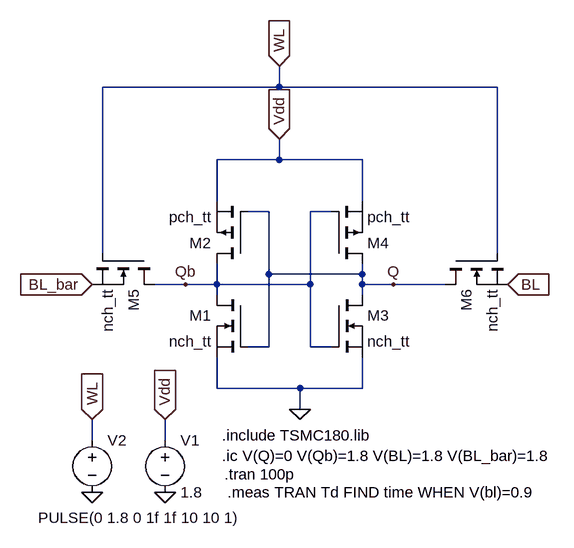
[diagram p0: schematic Prob_1.asc]
Prob_1.asc, the LTspice schematic file:
Version 4
SHEET 1 880 680
WIRE 240 -176 240 -208
WIRE 240 -176 -32 -176
WIRE 576 -176 240 -176
WIRE 240 -64 240 -96
WIRE 240 -64 144 -64
WIRE 368 -64 240 -64
WIRE 144 0 144 -64
WIRE 368 0 368 -64
WIRE 224 16 192 16
WIRE 320 16 288 16
WIRE -32 80 -32 -176
WIRE 576 80 576 -176
WIRE 224 112 224 16
WIRE 368 112 368 96
WIRE 368 112 224 112
WIRE 96 128 48 128
WIRE 144 128 144 96
WIRE 144 128 96 128
WIRE 288 128 288 16
WIRE 288 128 144 128
WIRE 368 128 368 112
WIRE 416 128 368 128
WIRE 496 128 416 128
WIRE 144 144 144 128
WIRE 368 144 368 128
WIRE 224 224 224 112
WIRE 224 224 192 224
WIRE 288 224 288 128
WIRE 320 224 288 224
WIRE 144 288 144 240
WIRE 272 288 144 288
WIRE 368 288 368 240
WIRE 368 288 272 288
WIRE 272 320 272 288
WIRE -48 368 -48 336
WIRE 64 368 64 336
FLAG 272 320 0
FLAG 64 448 0
FLAG 64 336 Vdd
IOPIN 64 336 In
FLAG 240 -96 Vdd
IOPIN 240 -96 In
FLAG 240 -208 WL
IOPIN 240 -208 In
FLAG -48 128 BL_bar
IOPIN -48 128 In
FLAG 592 128 BL
IOPIN 592 128 In
FLAG 96 128 Qb
FLAG 416 128 Q
FLAG -48 448 0
FLAG -48 336 WL
IOPIN -48 336 In
SYMBOL nmos 192 144 M0
SYMATTR InstName M1
SYMATTR Value nch_tt
SYMATTR Value2 W=720n,L=180n
SYMBOL nmos 320 144 R0
SYMATTR InstName M3
SYMATTR Value nch_tt
SYMATTR Value2 W=720n,L=180n
SYMBOL pmos 192 96 R180
SYMATTR InstName M2
SYMATTR Value pch_tt
SYMATTR Value2 W=270n,L=270n
SYMBOL pmos 320 96 M180
SYMATTR InstName M4
SYMATTR Value pch_tt
SYMATTR Value2 W=270n,L=270n
SYMBOL nmos 48 80 R90
SYMATTR InstName M5
SYMATTR Value nch_tt
SYMATTR Value2 W=360n,L=180n
SYMBOL nmos 496 80 M90
SYMATTR InstName M6
SYMATTR Value nch_tt
SYMATTR Value2 W=360n,L=180n
SYMBOL voltage 64 352 R0
WINDOW 123 0 0 Left 0
WINDOW 39 0 0 Left 0
SYMATTR InstName V1
SYMATTR Value 1.8
SYMBOL voltage -48 352 R0
WINDOW 3 -83 135 Left 2
WINDOW 123 0 0 Left 0
WINDOW 39 0 0 Left 0
SYMATTR InstName V2
SYMATTR Value PULSE(0 1.8 0 1f 1f 10 10 1)
TEXT 152 360 Left 2 !.include TSMC180.lib
TEXT 152 392 Left 2 !.ic V(Q)=0 V(Qb)=1.8 V(BL)=1.8 V(BL_bar)=1.8
TEXT 156 420 Left 2 !.tran 100p
TEXT 160 448 Left 2 !.meas TRAN Td FIND time WHEN V(bl)=0.9

The netlist it stands for:
* Prob_1.asc
M1 Qb Q 0 0 nch_tt W=720n,L=180n
M3 Q Qb 0 0 nch_tt W=720n,L=180n
M2 Qb Q Vdd Vdd pch_tt W=270n,L=270n
M4 Q Qb Vdd Vdd pch_tt W=270n,L=270n
M5 Qb WL BL_bar BL_bar nch_tt W=360n,L=180n
M6 Q WL BL BL nch_tt W=360n,L=180n
V1 Vdd 0 1.8
V2 WL 0 PULSE(0 1.8 0 1f 1f 10 10 1)
.model NMOS NMOS
.model PMOS PMOS
.lib standard.mos
.include TSMC180.lib
.ic V(Q)=0 V(Qb)=1.8 V(BL)=1.8 V(BL_bar)=1.8
.tran 100p
.meas TRAN Td FIND time WHEN V(bl)=0.9
.backanno
.end

* Results of the author's LTspice run, read from the files saved beside the schematic
* Operating Point, zero values left out:
*   V(qb) = 1.8 V
*   V(vdd) = 1.8 V
*   V(bl_bar) = 1.8 V
*   V(bl) = 1.8 V
*   Id(M4) = -5.574 pA
*   Ib(M4) = 1.81 pA
*   Is(M4) = 3.764 pA
*   Id(M6) = -4.066 A
*   Ib(M6) = 4.066 A
*   Is(M6) = 412.3 µA
*   Id(M1) = 14.65 pA
*   Ib(M1) = -1.81 pA
*   Is(M1) = -12.84 pA
*   I(V1) = -5.574 pA
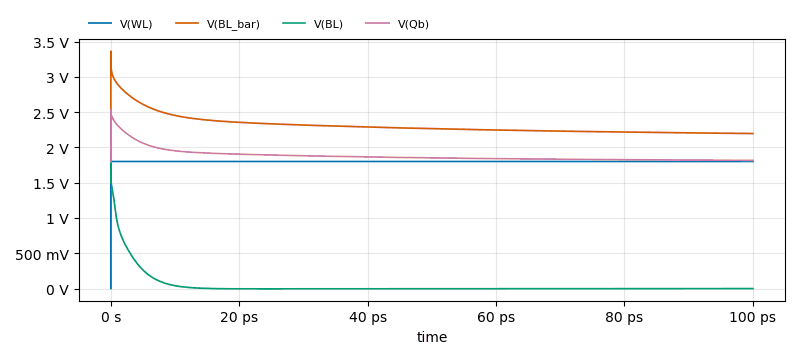
[diagram p1: Transient Analysis of Prob_1.asc, plotted from the saved traces]
* Transient Analysis, 1 run:
*   V(WL): min 0 V, max 1.8 V, average 1.8 V, rms 1.8 V, last 1.8 V
*   V(BL_bar): min 1.8 V, max 3.362 V, average 2.309 V, rms 2.313 V, last 2.196 V
*   V(BL): min -4.266 mV, max 1.806 V, average 38.55 mV, rms 170.6 mV, last -717.3 µV
*   V(Qb): min 1.8 V, max 2.534 V, average 1.88 V, rms 1.882 V, last 1.816 V
* From the log:
*   td: time=1.0899e-012 at 1.0899e-012